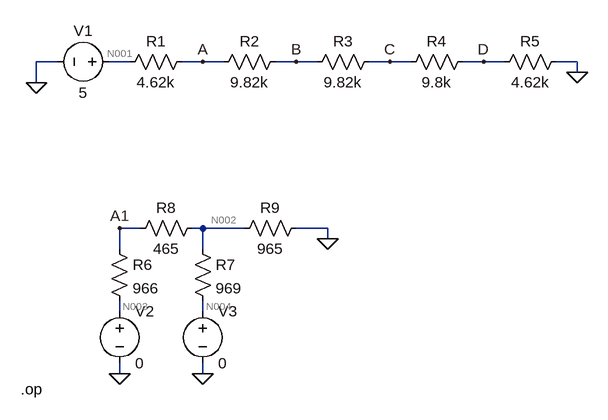
[diagram p0: schematic Lab3.asc]
Lab3.asc, the LTspice schematic file:
Version 4
SHEET 1 880 680
WIRE -128 112 -160 112
WIRE -16 112 -48 112
WIRE 96 112 64 112
WIRE 128 112 96 112
WIRE 240 112 208 112
WIRE 272 112 240 112
WIRE 384 112 352 112
WIRE 416 112 384 112
WIRE 528 112 496 112
WIRE 560 112 528 112
WIRE 672 112 640 112
WIRE 672 128 672 112
WIRE -160 144 -160 112
WIRE 0 368 -32 368
WIRE 96 368 80 368
WIRE 160 368 96 368
WIRE 288 368 240 368
WIRE 288 384 288 368
WIRE -32 400 -32 368
WIRE 96 400 96 368
WIRE -32 496 -32 480
WIRE 96 496 96 480
WIRE -32 592 -32 576
WIRE 96 592 96 576
FLAG 672 128 0
FLAG -160 144 0
FLAG 96 112 A
FLAG 240 112 B
FLAG 384 112 C
FLAG 528 112 D
FLAG 288 384 0
FLAG 96 592 0
FLAG -32 592 0
FLAG -32 368 A1
SYMBOL res 80 96 R90
WINDOW 0 0 56 VBottom 2
WINDOW 3 32 56 VTop 2
SYMATTR InstName R1
SYMATTR Value 4.62k
SYMBOL res 224 96 R90
WINDOW 0 0 56 VBottom 2
WINDOW 3 32 56 VTop 2
SYMATTR InstName R2
SYMATTR Value 9.82k
SYMBOL res 368 96 R90
WINDOW 0 0 56 VBottom 2
WINDOW 3 32 56 VTop 2
SYMATTR InstName R3
SYMATTR Value 9.82k
SYMBOL res 512 96 R90
WINDOW 0 0 56 VBottom 2
WINDOW 3 32 56 VTop 2
SYMATTR InstName R4
SYMATTR Value 9.8k
SYMBOL res 656 96 R90
WINDOW 0 0 56 VBottom 2
WINDOW 3 32 56 VTop 2
SYMATTR InstName R5
SYMATTR Value 4.62k
SYMBOL voltage -32 112 R90
WINDOW 0 -32 56 VBottom 2
WINDOW 3 32 56 VTop 2
SYMATTR InstName V1
SYMATTR Value 5
SYMBOL res -48 384 R0
SYMATTR InstName R6
SYMATTR Value 966
SYMBOL res 80 384 R0
SYMATTR InstName R7
SYMATTR Value 969
SYMBOL res 96 352 R90
WINDOW 0 0 56 VBottom 2
WINDOW 3 32 56 VTop 2
SYMATTR InstName R8
SYMATTR Value 465
SYMBOL res 256 352 R90
WINDOW 0 0 56 VBottom 2
WINDOW 3 32 56 VTop 2
SYMATTR InstName R9
SYMATTR Value 965
SYMBOL voltage -32 480 R0
SYMATTR InstName V2
SYMATTR Value 0
SYMBOL voltage 96 480 R0
SYMATTR InstName V3
SYMATTR Value 0
TEXT -184 616 Left 2 !.op

The netlist it stands for:
* Lab3.asc
R1 A N001 4.62k
R2 B A 9.82k
R3 C B 9.82k
R4 D C 9.8k
R5 0 D 4.62k
V1 N001 0 5
R6 A1 N003 966
R7 N002 N004 969
R8 N002 A1 465
R9 0 N002 965
V2 N003 0 0
V3 N004 0 0
.op
.backanno
.end

* Results of the author's LTspice run, read from the files saved beside the schematic
* Operating Point:
*   V(a) = 4.403 V
*   V(n001) = 5 V
*   V(b) = 3.133 V
*   V(c) = 1.864 V
*   V(d) = 597.2 mV
*   V(a1) = 0 V
*   V(n003) = 0 V
*   V(n002) = 0 V
*   V(n004) = 0 V
*   I(R9) = 0 A
*   I(R8) = 0 A
*   I(R7) = 0 A
*   I(R6) = 0 A
*   I(R5) = -129.3 µA
*   I(R4) = -129.3 µA
*   I(R3) = -129.3 µA
*   I(R2) = -129.3 µA
*   I(R1) = -129.3 µA
*   I(V3) = 0 A
*   I(V2) = 0 A
*   I(V1) = -129.3 µA